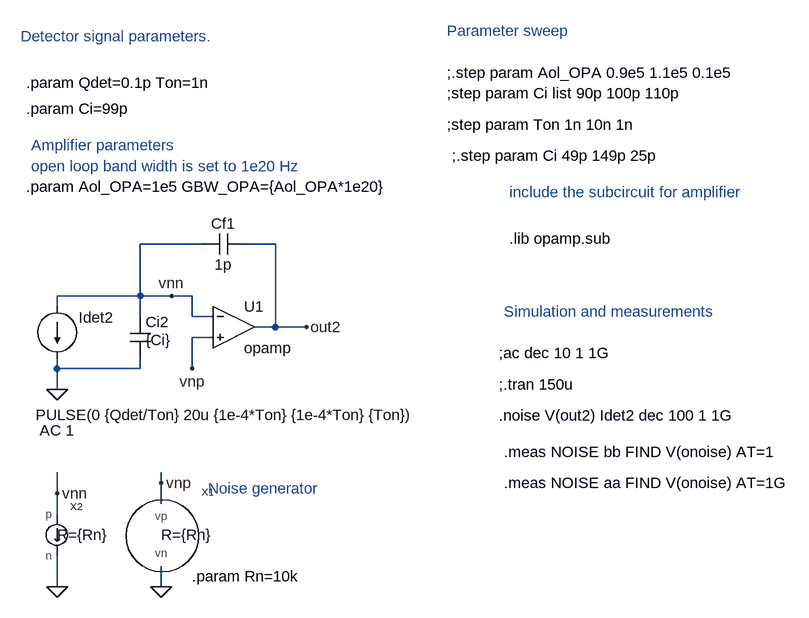
[diagram p0: schematic 03_CSA_Noise_PSD.asc]
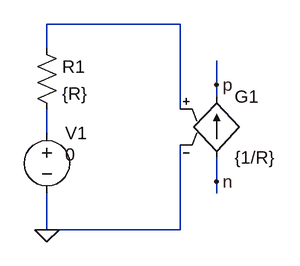
[diagram p1: sub-circuit inoise.asc]
03_CSA_Noise_PSD.asc, the LTspice schematic file:
Version 4
SHEET 1 988 720
WIRE -688 -48 -784 -48
WIRE -576 -48 -624 -48
WIRE -784 32 -784 -48
WIRE -784 32 -912 32
WIRE -736 32 -784 32
WIRE -704 32 -736 32
WIRE -912 48 -912 32
WIRE -784 64 -784 32
WIRE -704 64 -704 32
WIRE -672 64 -704 64
WIRE -576 80 -576 -48
WIRE -576 80 -608 80
WIRE -528 80 -576 80
WIRE -672 96 -704 96
WIRE -912 144 -912 128
WIRE -784 144 -784 128
WIRE -784 144 -912 144
WIRE -704 144 -704 96
WIRE -912 176 -912 144
WIRE -752 320 -752 304
WIRE -912 336 -912 304
WIRE -752 352 -752 320
WIRE -912 368 -912 336
WIRE -912 480 -912 432
WIRE -752 480 -752 448
FLAG -912 176 0
FLAG -528 80 out2
FLAG -752 480 0
FLAG -912 480 0
FLAG -704 144 vnp
FLAG -752 320 vnp
FLAG -912 336 vnn
FLAG -736 32 vnn
SYMBOL cap -800 64 R0
WINDOW 3 24 36 Left 2
SYMATTR Value {Ci}
SYMATTR InstName Ci2
SYMBOL cap -624 -64 R90
WINDOW 0 0 32 VBottom 2
WINDOW 3 32 32 VTop 2
SYMATTR InstName Cf1
SYMATTR Value 1p
SYMBOL Opamps\\opamp -640 16 R0
SYMATTR InstName U1
SYMATTR SpiceLine Aol={Aol_OPA}
SYMATTR SpiceLine2 GBW={GBW_OPA}
SYMBOL current -912 48 R0
WINDOW 0 33 17 Left 2
WINDOW 123 -27 191 Left 2
WINDOW 39 0 0 Left 2
WINDOW 3 -33 167 Left 2
SYMATTR InstName Idet2
SYMATTR Value2 AC 1
SYMATTR Value PULSE(0 {Qdet/Ton} 20u {1e-4*Ton} {1e-4*Ton} {Ton})
SYMBOL vnoise -752 400 R0
WINDOW 39 0 0 Left 2
SYMATTR SpiceLine R={Rn}
SYMATTR InstName X1
SYMBOL inoise -912 400 R0
WINDOW 39 0 0 Left 2
SYMATTR SpiceLine R={Rn}
SYMATTR InstName X2
TEXT -960 -296 Left 2 !.param Qdet=0.1p Ton=1n
TEXT -960 -136 Left 2 !.param Aol_OPA=1e5 GBW_OPA={Aol_OPA*1e20}
TEXT -232 168 Left 2 !;.tran 150u
TEXT -312 -312 Left 2 !;.step param Aol_OPA 0.9e5 1.1e5 0.1e5
TEXT -216 -56 Left 2 !.lib opamp.sub
TEXT -960 -256 Left 2 !.param Ci=99p
TEXT -312 -232 Left 2 !;step param Ton 1n 10n 1n
TEXT -968 -368 Left 2 ;Detector signal parameters.
TEXT -216 -128 Left 2 ;include the subcircuit for amplifier
TEXT -232 120 Left 2 !;ac dec 10 1 1G
TEXT -224 56 Left 2 ;Simulation and measurements
TEXT -312 -280 Left 2 !;step param Ci list 90p 100p 110p
TEXT -952 -200 Left 2 ;Amplifier parameters
TEXT -952 -168 Left 2 ;open loop band width is set to 1e20 Hz
TEXT -312 -376 Left 2 ;Parameter sweep
TEXT -232 216 Left 2 !.noise V(out2) Idet2 dec 100 1 1G
TEXT -704 464 Left 2 !.param Rn=10k
TEXT -304 -184 Left 2 !;.step param Ci 49p 149p 25p
TEXT -680 328 Left 2 ;Noise generator
TEXT -224 272 Left 2 !.meas NOISE bb FIND V(onoise) AT=1
TEXT -224 320 Left 2 !.meas NOISE aa FIND V(onoise) AT=1G

inoise.asc, the sub-circuit schematic file:
Version 4
SHEET 1 880 680
WIRE 352 64 176 64
WIRE 176 96 176 64
WIRE 400 144 400 112
WIRE 400 160 400 144
WIRE 352 176 352 64
WIRE 176 208 176 176
WIRE 400 272 400 240
WIRE 400 288 400 272
WIRE 176 336 176 288
WIRE 352 336 352 224
WIRE 352 336 176 336
FLAG 400 144 p
FLAG 400 272 n
FLAG 176 336 0
SYMBOL res 160 80 R0
SYMATTR InstName R1
SYMATTR Value {R}
SYMBOL voltage 176 192 R0
WINDOW 123 0 0 Left 2
WINDOW 39 0 0 Left 2
WINDOW 3 24 44 Left 2
SYMATTR InstName V1
SYMATTR Value 0
SYMBOL g 400 144 R0
SYMATTR InstName G1
SYMATTR Value {1/R}

The netlist it stands for:
* 03_CSA_Noise_PSD.asc
Ci2 vnn 0 {Ci}
Cf1 out2 vnn 1p
XU1 vnn vnp out2 opamp Aol={Aol_OPA} GBW={GBW_OPA}  ; pins invin noninvin out
Idet2 vnn 0 PULSE(0 {Qdet/Ton} 20u {1e-4*Ton} {1e-4*Ton} {Ton}) AC 1
XX1 vnp 0 vnoise params: R={Rn}  ; pins vp vn
XX2 vnn 0 inoise params: R={Rn}

* block symbol definitions
.subckt inoise p n
R1 N001 N002 {R}
V1 N002 0 0
G1 n p N001 0 {1/R}
.ends inoise

.param Qdet=0.1p Ton=1n
.param Aol_OPA=1e5 GBW_OPA={Aol_OPA*1e20}
;.tran 150u
;.step param Aol_OPA 0.9e5 1.1e5 0.1e5
.lib opamp.sub
.param Ci=99p
;step param Ton 1n 10n 1n
* Detector signal parameters.
* include the subcircuit for amplifier
;ac dec 10 1 1G
* Simulation and measurements
;step param Ci list 90p 100p 110p
* Amplifier parameters
* open loop band width is set to 1e20 Hz
* Parameter sweep
.noise V(out2) Idet2 dec 100 1 1G
.param Rn=10k
;.step param Ci 49p 149p 25p
* Noise generator
.meas NOISE bb FIND V(onoise) AT=1
.meas NOISE aa FIND V(onoise) AT=1G
.backanno
.end